# EAGLE schematic temp_sensor (EAGLE 6.5.0)
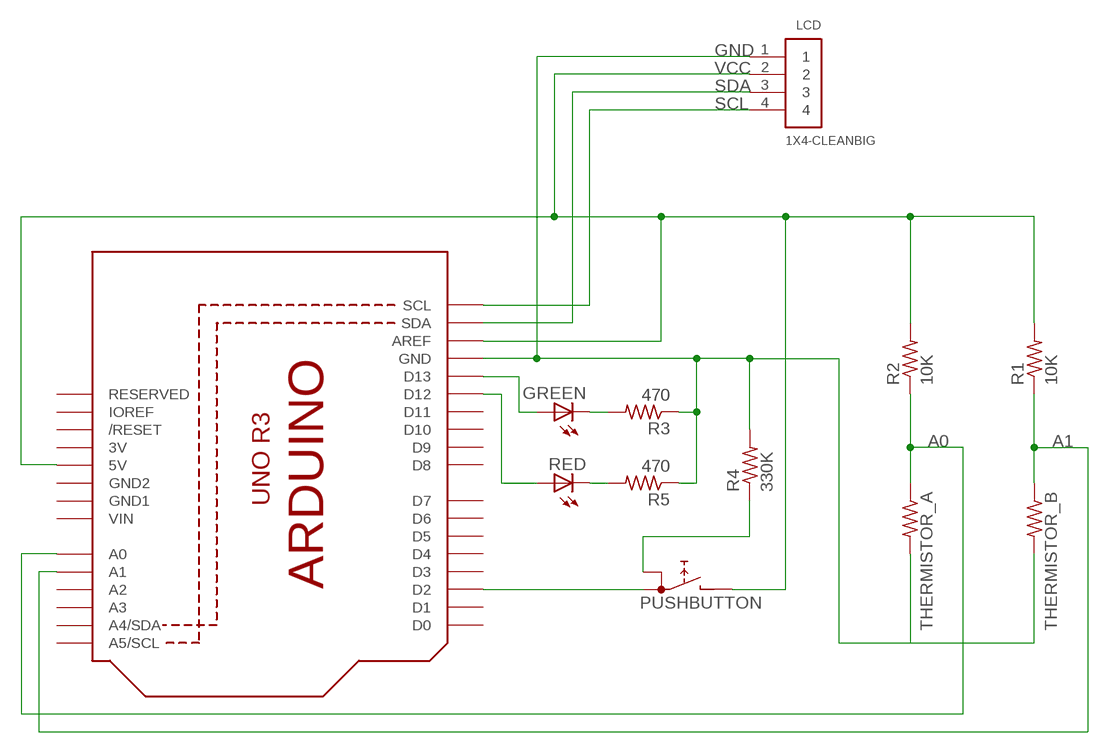
[diagram p0: schematic, sheet 1]

## Parts
GREEN  LED3MM  [LED3MM]
LCD  1X4-CLEANBIG  [1X04-CLEANBIG]
PUSHBUTTON  RDT1034  [RDT1034]
R1  10K  R-US_0204/7  [0204/7]
R2  10K  R-US_0204/7  [0204/7]
R3  470  R-US_0204/7  [0204/7]
R4  330K  R-US_0204/7  [0204/7]
R5  470  R-US_0204/7  [0204/7]
RED  LED3MM  [LED3MM]
THERMISTOR_A  R-US_0204/7  [0204/7]
THERMISTOR_B  R-US_0204/7  [0204/7]
U1  ARDUINOR3-DIMENSION  [ARDUINOR3]

## Nets
A0: R2.1 THERMISTOR_A.1 U1.A0
A1: R1.1 THERMISTOR_B.1 U1.A1
GND: LCD.1 R3.1 R4.2 R5.1 THERMISTOR_A.2 THERMISTOR_B.2 U1.GND
N$1: PUSHBUTTON.A R4.1
N$2: GREEN.A U1.D13
N$3: PUSHBUTTON.A1 U1.D2
N$4: RED.A U1.D12
N$5: GREEN.K(C) R3.2
N$6: R5.2 RED.K(C)
SCL: LCD.4 U1.SCL
SDA: LCD.3 U1.SDA
VCC: LCD.2 PUSHBUTTON.B R1.2 R2.2 U1.5V U1.AREF
Unconnected: U1.A2 U1.A3 U1.A4(A4/SDA) U1.A5(A5/SCL) U1.D0 U1.D1 U1.D3 U1.D4 U1.D5 U1.D6 U1.D7 U1.D8 U1.D9 U1.D10 U1.D11 U1.IOREF U1.RESERVED U1.RESET(/RESET)

## Power pins joined to a net without a drawn wire
3V: U1.3V
GND1: U1.GND1
GND2: U1.GND2
VIN: U1.VIN

## Library data of the parts
GREEN RED = led:LED: LED OSRAM: - CHIPLED LG R971, LG N971, LY N971, LG Q971, LY Q971, LO R971, LY R971 LH N974, LH R974 LS Q976, LO Q976, LY Q976 LO Q996 - Hyper CHIPLED LW Q18S LB Q993, LB Q99A, LB R99A - SideLED LS A670, LO A670, LY A670, LG A670, LP A670 LB A673, LV A673, LT A673, LW A673 LH A674 LY A675 LS A676, LA A676, LO A676, LY A676, LW A676 LS A679, LY A679, LG A679 - Hyper Micro SIDELED® LS Y876, LA Y876, LO Y876, LY Y876 LT Y87S - SmartLED LW L88C, LW L88S LB L89C, LB L89S, LG L890 LS L89K, LO L89K, LY L89K LS L896, LA L896, LO L896, LY L896 - TOPLED LS T670, LO T670, LY T670, LG T670, LP T670 LSG T670, LSP T670, LSY T670, LOP T670, LYG T670 LG T671, LOG T671, LSG T671 LB T673, LV T673, LT T673, LW T673 LH T674 LS T676, LA T676, LO T676, LY T676, LB T676, LH T676, LSB T676, LW T676 LB T67C, LV T67C, LT T67C, LS T67K, LO T67K, LY T67K, LW E67C LS E67B, LA E67B, LO E67B, LY E67B, LB E67C, LV E67C, LT E67C LW T67C LS T679, LY T679, LG T679 LS T770, LO T770, LY T770, LG T770, LP T770 LB T773, LV T773, LT T773, LW T773 LH T774 LS E675, LA E675, LY E675, LS T675 LS T776, LA T776, LO T776, LY T776, LB T776 LHGB T686 LT T68C, LB T68C - Hyper Mini TOPLED® LB M676 - Mini TOPLED Santana® LG M470 LS M47K, LO M47K, LY M47K Source: http://www.osram.convergy.de LUXEON: - LUMILED® LXK2-PW12-R00, LXK2-PW12-S00, LXK2-PW14-U00, LXK2-PW14-V00 LXK2-PM12-R00, LXK2-PM12-S00, LXK2-PM14-U00 LXK2-PE12-Q00, LXK2-PE12-R00, LXK2-PE12-S00, LXK2-PE14-T00, LXK2-PE14-U00 LXK2-PB12-K00, LXK2-PB12-L00, LXK2-PB12-M00, LXK2-PB14-N00, LXK2-PB14-P00, LXK2-PB14-Q00 LXK2-PR12-L00, LXK2-PR12-M00, LXK2-PR14-Q00, LXK2-PR14-R00 LXK2-PD12-Q00, LXK2-PD12-R00, LXK2-PD12-S00 LXK2-PH12-R00, LXK2-PH12-S00 LXK2-PL12-P00, LXK2-PL12-Q00, LXK2-PL12-R00 Source: www.luxeon.com KINGBRIGHT: KA-3528ASYC Source: www.kingbright.com
LCD = adafruit:1X4: 4-pin connector
PUSHBUTTON = switch:RDT1034: PUSH SWITCH www.radiohm.com
R1-R5 THERMISTOR_A THERMISTOR_B = resistor:R-US_: RESISTOR, American symbol
U1 = adafruit:ARDUINOR3: This is a new object for the new Arduino R3 - with extra pins that you may want to use (such as IOref, and duplicated A4/A5